# Altium schematic sheet GC9A01.SchDoc
size A4; SheetNumber: 1; SheetTotal: 1
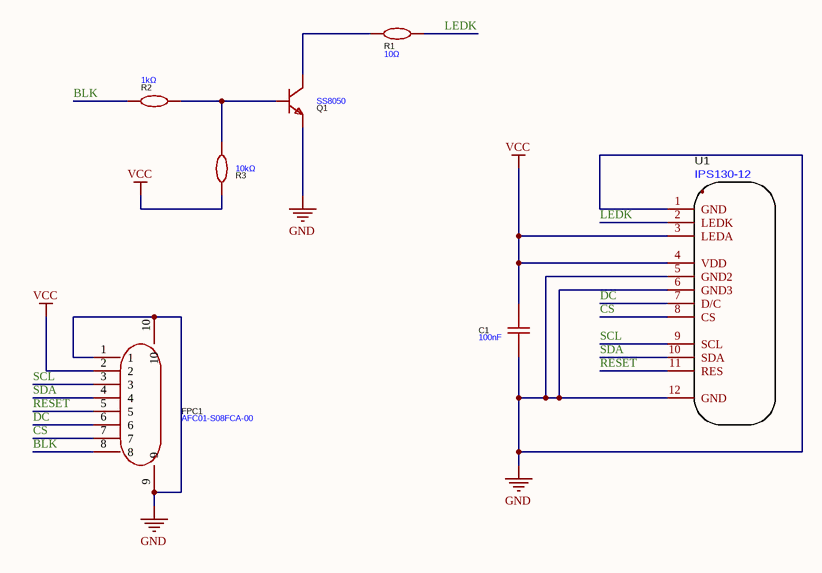
[diagram p0: GC9A01.SchDoc]

## Parts
C1  100nF  [C0603]
FPC1  AFC01-S08FCA-00  [FPC-SMD_P0.50-8P_FGS-XJ-H2.0]
Q1  SS8050  [SOT-23-3_L2.9-W1.3-P1.90-LS2.4-BR]
R1  10Ω  [R0603]
R2  1kΩ  [R0603]
R3  10kΩ  [R0603]
U1  IPS130-12  [FPC_0.7-12P_SMT]

## Nets
GND: C1.1 FPC1.1 FPC1.9 FPC1.10 Q1.2(E) U1.1(GND) U1.5(GND2) U1.6(GND3) U1.12(GND)
VCC: C1.2 FPC1.2 R3.1 U1.3(LEDA) U1.4(VDD)
BLK: FPC1.8 R2.1
CS: FPC1.7 U1.8(CS)
DC: FPC1.6 U1.7(D/C)
LEDK: R1.2 U1.2(LEDK)
RESET: FPC1.5 U1.11(RES)
SCL: FPC1.3 U1.9(SCL)
SDA: FPC1.4 U1.10(SDA)
NetQ1_1: Q1.1(B) R2.2 R3.2
NetQ1_3: Q1.3(C) R1.1

## Library data of the parts
C1 = CL10B104KB8NNNC: Manufacturer: SAMSUNG(三星); Add into BOM: yes; Tolerance: ±10%; Voltage Rated: 50V; Temperature Coefficient: X7R; Symbol: CL10B104KB8NNNC; Device: CL10B104KB8NNNC; LCSC Part Name: 100nF ±10% 50V; Supplier Part: C1591; Manufacturer Part: CL10B104KB8NNNC; Supplier Footprint: 0603; JLCPCB Part Class: Extended Part; Datasheet: https://atta.szlcsc.com/upload/public/pdf/source/20160218/1457707763339.pdf; Supplier: LCSC; Convert to PCB: yes; Value: 100nF
FPC1 = AFC01-S08FCA-00: Manufacturer: JS(钜硕电子); Add into BOM: yes; Locking Feature: 翻盖式; Number of Contacts: 8P; Pitch: 0.5mm; FFC, FCB Thickness: 0.3mm; Symbol: AFC01-S08FCA-00; Device: AFC01-S08FCA-00; LCSC Part Name: 间距:0.5mm P数:8P 翻盖式 下接; Supplier Part: C262657; Manufacturer Part: AFC01-S08FCA-00; Supplier Footprint: SMD,P=0.5mm,卧贴; JLCPCB Part Class: Extended Part; Datasheet: https://atta.szlcsc.com/upload/public/pdf/source/20190816/C413942_2A72D1AC756EAE17EEDF756A339D4500.pdf; Supplier: LCSC; Convert to PCB: yes; Contact Type: 下接; Mounting Type: 卧贴; Height Above Board: 2mm
Q1 = SS8050_C541705: Manufacturer: AnBon(安邦); Add into BOM: yes; Transistor Type: NPN; Collector Current (Ic): 1.5A; Collector-Emitter Breakdown Voltage (Vceo): 25V; Power Dissipation (Pd): 225mW; DC Current Gain (hFE@Ic,Vce): 200@100mA,1V; Collector Cut-Off Current (Icbo): 150nA; Collector-Emitter Saturation Voltage (VCE(sat)@Ic,Ib): 500mV@800mA,80mA; Symbol: SS8050_C541705; Device: SS8050_C541705; LCSC Part Name: 耐压:25V 电流:1.5A NPN; Supplier Part: C541705; Manufacturer Part: SS8050; Supplier Footprint: SOT-23; JLCPCB Part Class: Extended Part; Datasheet: https://atta.szlcsc.com/upload/public/pdf/source/20200522/C541705_DD3461D9C64B1D59801CB3041082AFC6.pdf; Supplier: LCSC; Convert to PCB: yes; Transition Frequency (fT): -; Operating Temperature: -55℃~+150℃@(Tj)
R1 = 0603WAF100JT5E: Manufacturer: UNI-ROYAL(厚声); Add into BOM: yes; Tolerance: ±1%; Power(Watts): 100mW; Overload Voltage (Max): 75V; Temperature Coefficient: ±400ppm/℃; Symbol: 0603WAF100JT5E; Device: 0603WAF100JT5E; LCSC Part Name: 10Ω ±1% 100mW 厚膜电阻; Supplier Part: C22859; Manufacturer Part: 0603WAF100JT5E; Supplier Footprint: 0603; JLCPCB Part Class: Basic Part; Datasheet: https://atta.szlcsc.com/upload/public/pdf/source/20200306/C422600_1E6D84923E4A46A82E41ADD87F860B5C.pdf; Supplier: LCSC; Convert to PCB: yes; Type: 厚膜电阻; Value: 10Ω; Operating Temperature Range: -55℃~+155℃
R2 = 0603WAF1001T5E: Manufacturer: UNI-ROYAL(厚声); Add into BOM: yes; Tolerance: ±1%; Power(Watts): 100mW; Overload Voltage (Max): 75V; Temperature Coefficient: ±100ppm/℃; Symbol: 0603WAF1001T5E; Device: 0603WAF1001T5E; LCSC Part Name: 1kΩ ±1% 100mW 厚膜电阻; Supplier Part: C21190; Manufacturer Part: 0603WAF1001T5E; Supplier Footprint: 0603; JLCPCB Part Class: Basic Part; Datasheet: https://atta.szlcsc.com/upload/public/pdf/source/20200306/C422600_1E6D84923E4A46A82E41ADD87F860B5C.pdf; Supplier: LCSC; Convert to PCB: yes; Type: 厚膜电阻; Value: 1kΩ; Operating Temperature Range: -55℃~+155℃
R3 = 0603WAF1002T5E: Manufacturer: UNI-ROYAL(厚声); Add into BOM: yes; Tolerance: ±1%; Power(Watts): 100mW; Overload Voltage (Max): 75V; Temperature Coefficient: ±100ppm/℃; Symbol: 0603WAF1002T5E; Device: 0603WAF1002T5E; LCSC Part Name: 厚膜电阻 10kΩ ±1% 100mW; Supplier Part: C25804; Manufacturer Part: 0603WAF1002T5E; Supplier Footprint: 0603; JLCPCB Part Class: Basic Part; Datasheet: https://atta.szlcsc.com/upload/public/pdf/source/20200306/C422600_1E6D84923E4A46A82E41ADD87F860B5C.pdf; Supplier: LCSC; Convert to PCB: yes; Type: 厚膜电阻; Value: 10kΩ; Operating Temperature Range: -55℃~+155℃